# EAGLE design transponder-4.3 (EAGLE 9.6.1)
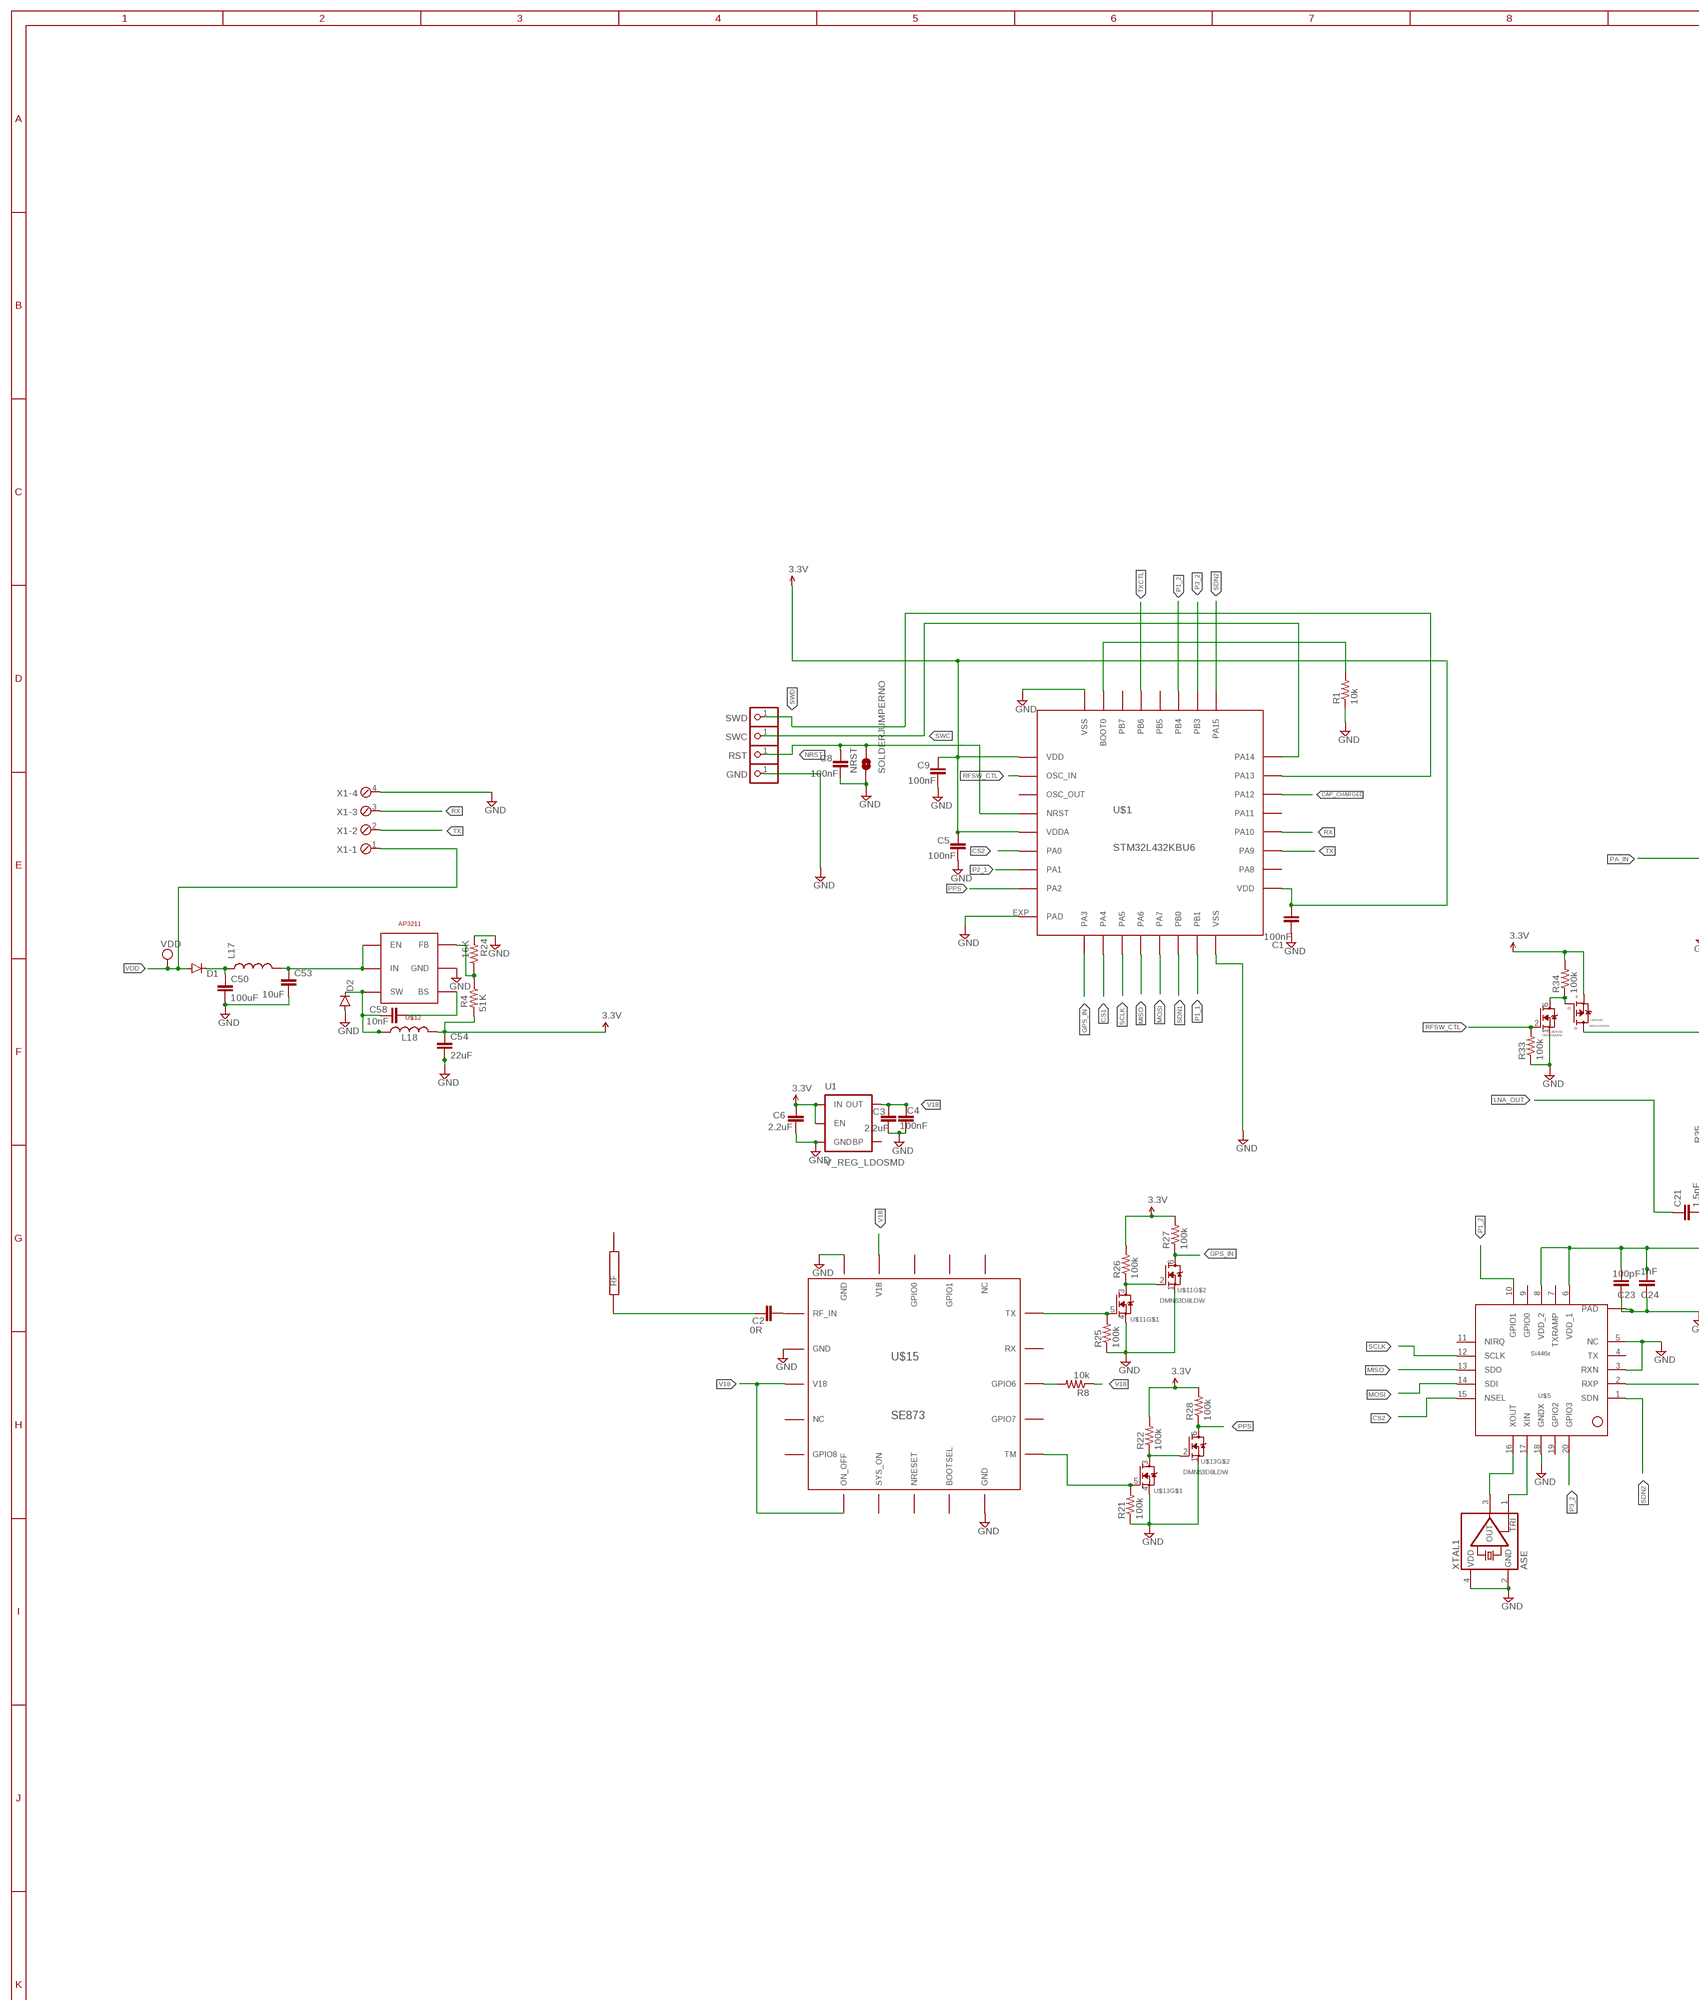
[diagram p0: schematic, sheet 1, part 1 of 3]
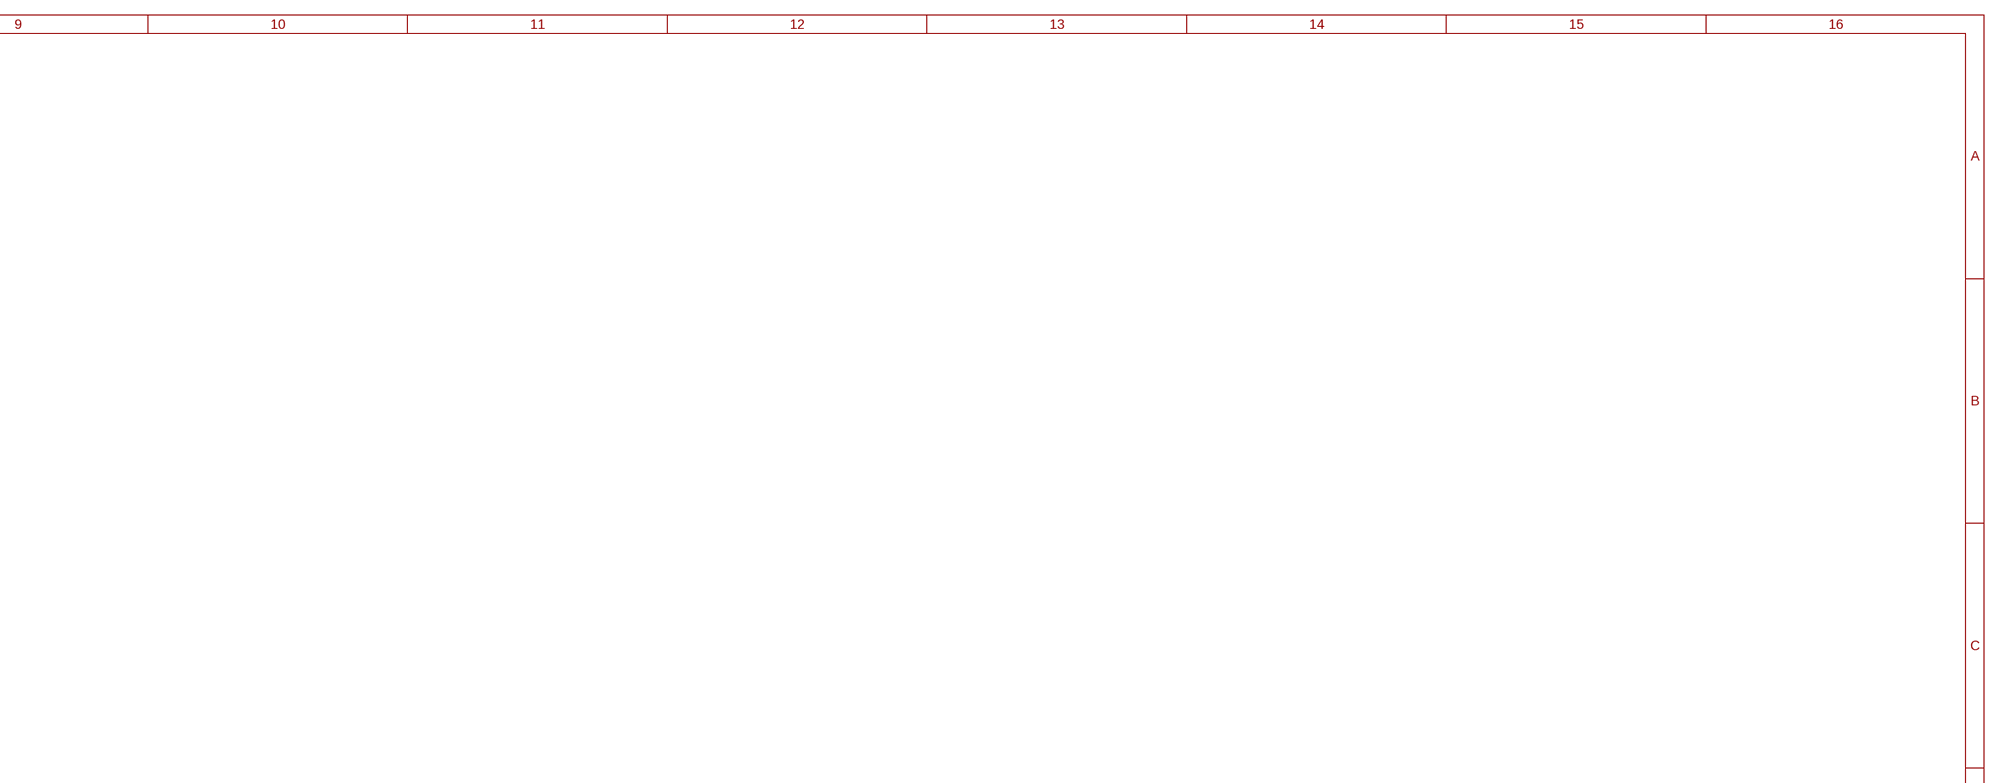
[diagram p1: schematic, sheet 1, part 2 of 3]
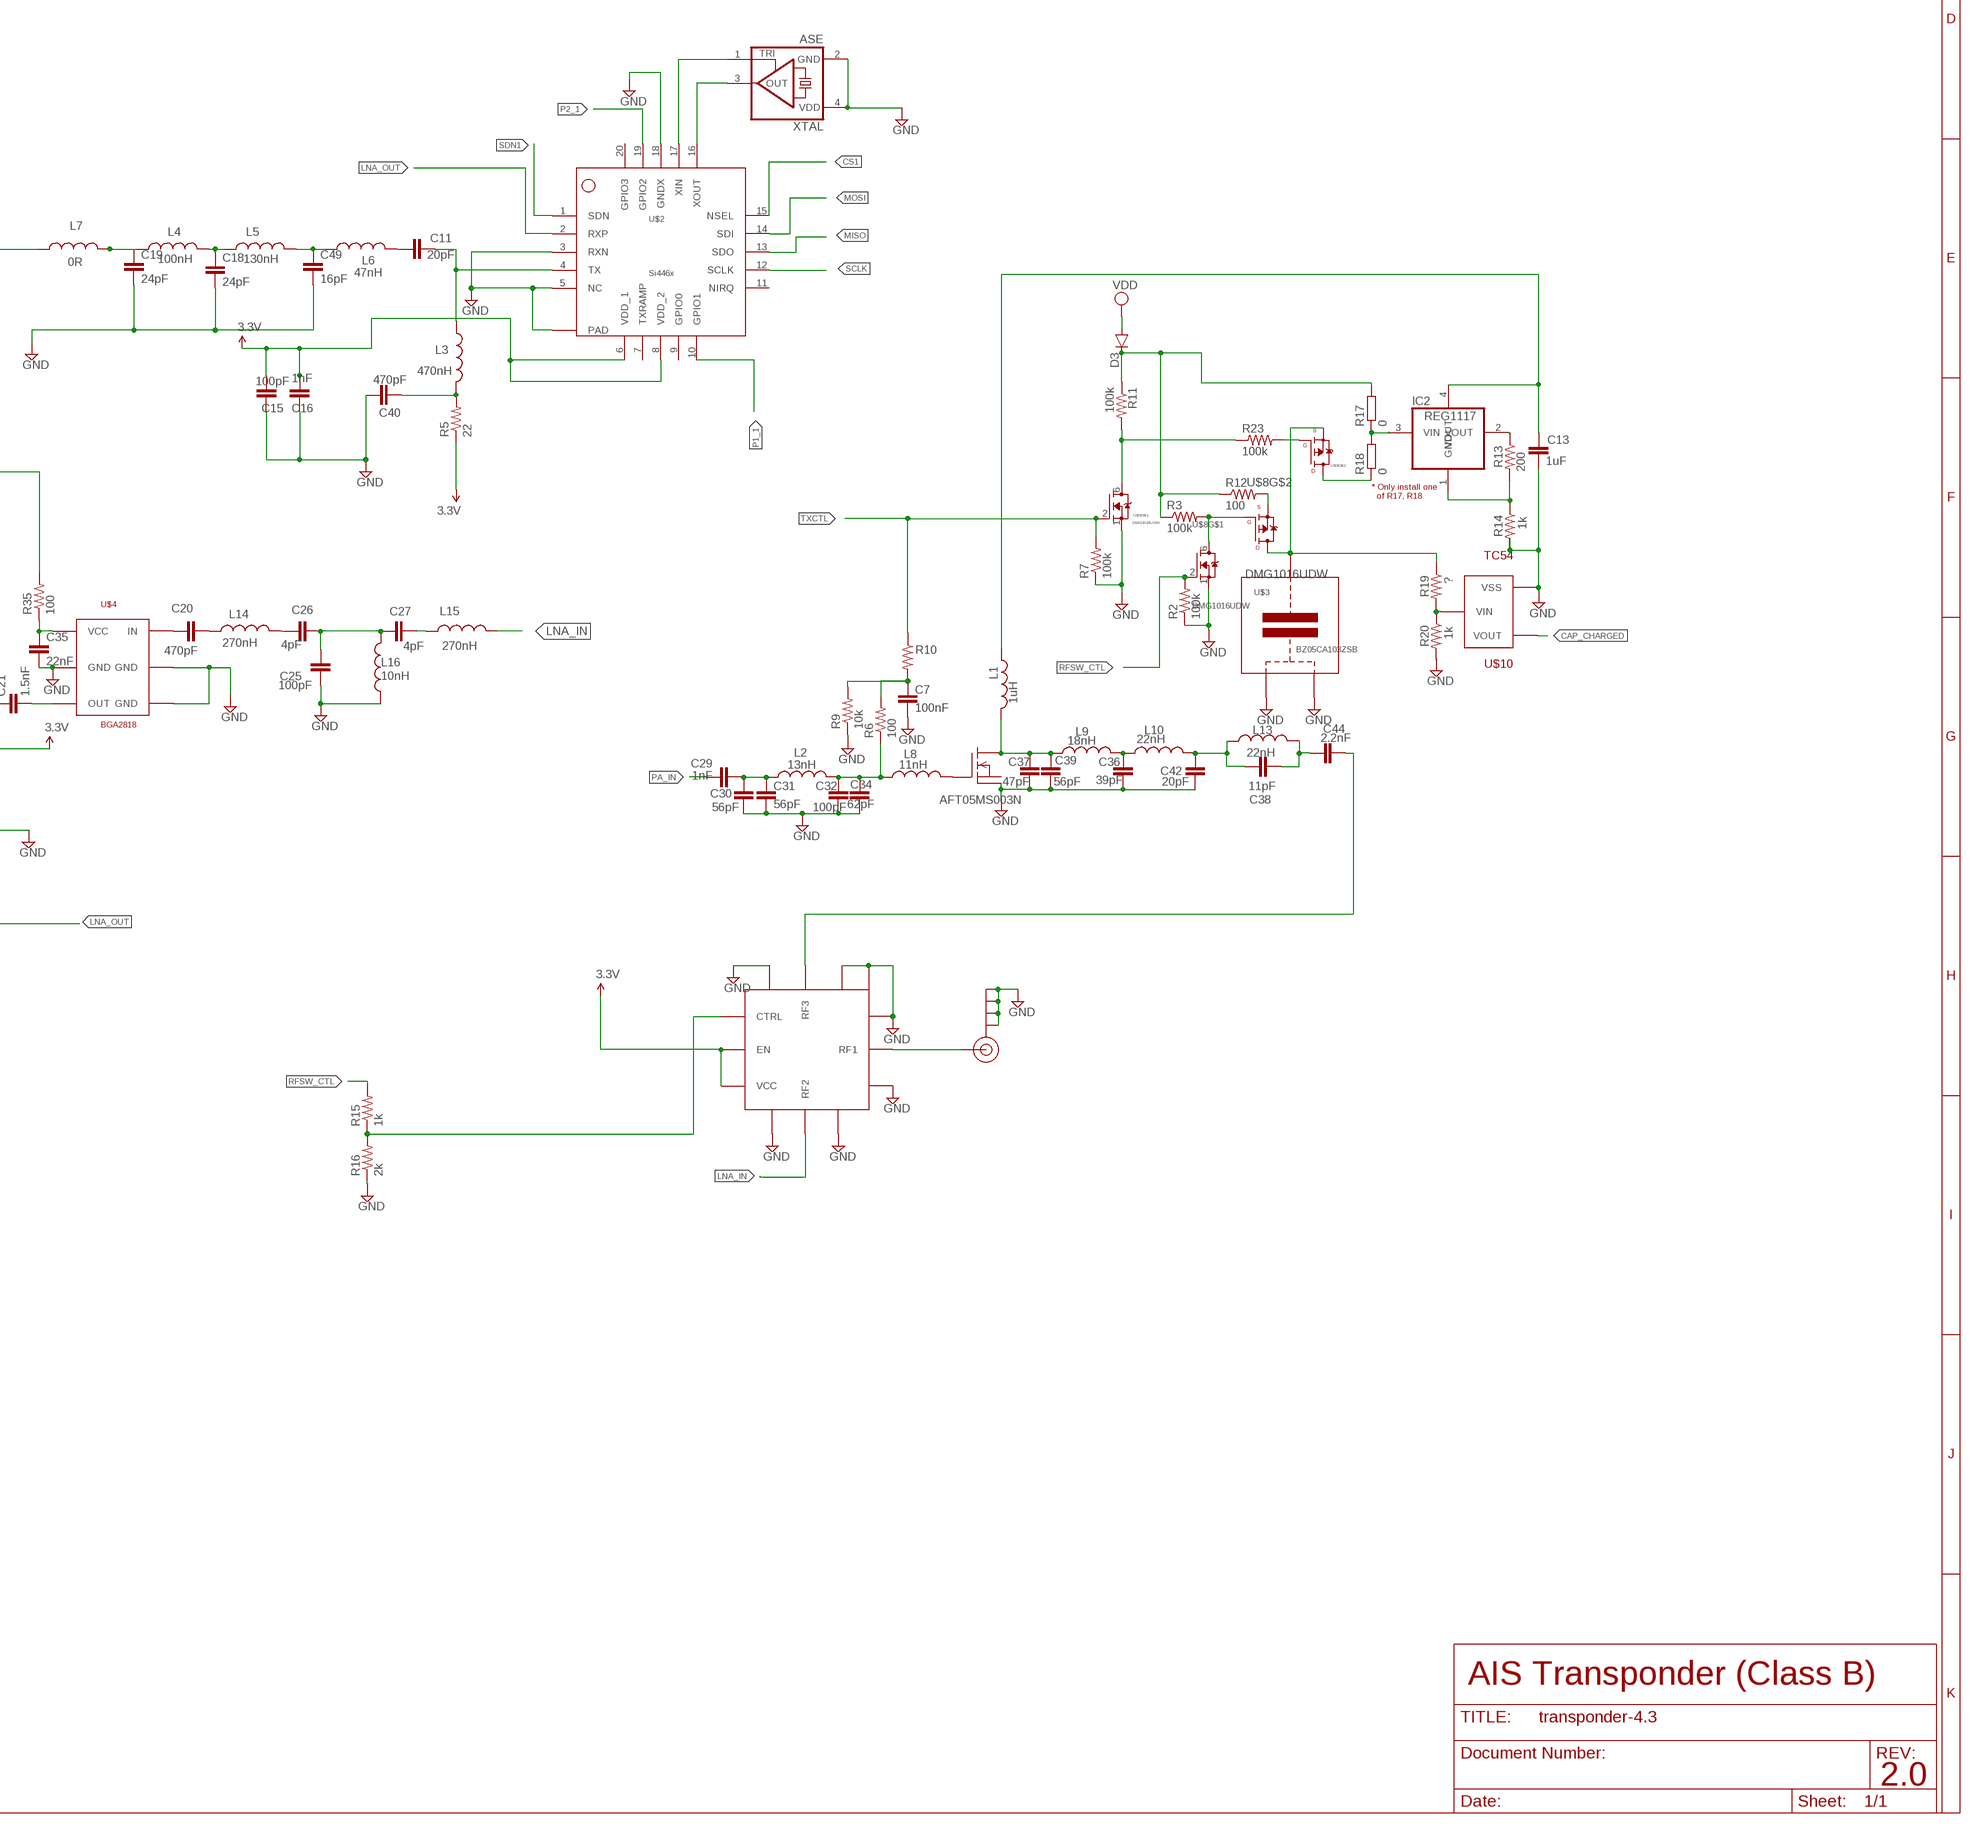
[diagram p2: schematic, sheet 1, part 3 of 3]

## Parts
C1  100nF  CAP0603-CAP  [0603-CAP]
C2  0R  CAP0603-CAP  [0603-CAP]
C3  2.2uF  CAP0603-CAP  [0603-CAP]
C4  100nF  CAP0603-CAP  [0603-CAP]
C5  100nF  CAP0603-CAP  [0603-CAP]
C6  2.2uF  CAP0603-CAP  [0603-CAP]
C7  100nF  CAP0603-CAP  [0603-CAP]
C8  100nF  CAP0603-CAP  [0603-CAP]
C9  100nF  CAP0603-CAP  [0603-CAP]
C11  20pF  CAP0603-CAP  [0603-CAP]
C13  1uF  CAP0603-CAP  [0603-CAP]
C15  100pF  CAP0603-CAP  [0603-CAP]
C16  1nF  CAP0603-CAP  [0603-CAP]
C18  24pF  CAP0603-CAP  [0603-CAP]
C19  24pF  CAP0603-CAP  [0603-CAP]
C20  470pF  CAP0603-CAP  [0603-CAP]
C21  1.5nF  CAP0603-CAP  [0603-CAP]
C23  100pF  CAP0603-CAP  [0603-CAP]
C24  1nF  CAP0603-CAP  [0603-CAP]
C25  100pF  CAP0603-CAP  [0603-CAP]
C26  4pF  CAP0603-CAP  [0603-CAP]
C27  4pF  CAP0603-CAP  [0603-CAP]
C29  1nF  CAP0603-CAP  [0603-CAP]
C30  56pF  CAP0603-CAP  [0603-CAP]
C31  56pF  CAP0603-CAP  [0603-CAP]
C32  100pF  CAP0603-CAP  [0603-CAP]
C34  62pF  CAP0603-CAP  [0603-CAP]
C35  22nF  CAP0603-CAP  [0603-CAP]
C36  39pF  CAP0805  [0805]
C37  47pF  CAP0805  [0805]
C38  11pF  CAP0805  [0805]
C39  56pF  CAP0805  [0805]
C40  470pF  CAP0603-CAP  [0603-CAP]
C42  20pF  CAP0805  [0805]
C44  2.2nF  CAP0805  [0805]
C49  16pF  CAP0603-CAP  [0603-CAP]
C50  100uF  CAP1210  [1210]
C53  10uF  CAP0805  [0805]
C54  22uF  CAP0805  [0805]
C58  10nF  CAP0603-CAP  [0603-CAP]
D1  DIODESOD123  [SOD-123]
D2  DIODESOD123  [SOD-123]
D3  DIODESOD123  [SOD-123]
GND  PINHD-1X1  [1X01]
IC2  REG1117  [SOT223]
J$1  SMA_EDGE  [SMA-EDGE]
L1  1uH  INDUCTOR0805  [0805]
L2  13nH  INDUCTOR0603  [0603]
L3  470nH  INDUCTOR0603  [0603]
L4  100nH  INDUCTOR0603  [0603]
L5  130nH  INDUCTOR0603  [0603]
L6  47nH  INDUCTOR0603  [0603]
L7  0R  INDUCTOR0603  [0603]
L8  11nH  INDUCTOR0603  [0603]
L9  18nH  INDUCTOR0805  [0805]
L10  22nH  INDUCTOR0805  [0805]
L13  22nH  INDUCTOR0805  [0805]
L14  270nH  INDUCTOR0603  [0603]
L15  270nH  INDUCTOR0603  [0603]
L16  10nH  INDUCTOR0603  [0603]
L17  INDUCTOR1007  [1007]
L18  INDUCTOR0805  [0805]
NRST  SOLDERJUMPERNO  [SJ_2S-NO]
R1  10k  RESISTOR0603-RES  [0603-RES]
R2  100k  RESISTOR0603-RES  [0603-RES]
R3  100k  RESISTOR0603-RES  [0603-RES]
R4  51K  RESISTOR0603-RES  [0603-RES]
R5  22  RESISTOR0603-RES  [0603-RES]
R6  100  RESISTOR0603-RES  [0603-RES]
R7  100k  RESISTOR0603-RES  [0603-RES]
R8  10k  RESISTOR0603-RES  [0603-RES]
R9  10k  RESISTOR0603-RES  [0603-RES]
R10  RESISTOR0603-RES  [0603-RES]
R11  100k  RESISTOR0603-RES  [0603-RES]
R12  100  RESISTOR0603-RES  [0603-RES]
R13  200  RESISTOR0603-RES  [0603-RES]
R14  1k  RESISTOR0603-RES  [0603-RES]
R15  1k  RESISTOR0603-RES  [0603-RES]
R16  2k  RESISTOR0603-RES  [0603-RES]
R17  0  R-EU_R0603  [R0603]
R18  0  R-EU_R0603  [R0603]
R19  ?  RESISTOR0603-RES  [0603-RES]
R20  1k  RESISTOR0603-RES  [0603-RES]
R21  100k  RESISTOR0603-RES  [0603-RES]
R22  100k  RESISTOR0603-RES  [0603-RES]
R23  100k  RESISTOR0603-RES  [0603-RES]
R24  16K  RESISTOR0603-RES  [0603-RES]
R25  100k  RESISTOR0603-RES  [0603-RES]
R26  100k  RESISTOR0603-RES  [0603-RES]
R27  100k  RESISTOR0603-RES  [0603-RES]
R28  100k  RESISTOR0603-RES  [0603-RES]
R33  100k  RESISTOR0603-RES  [0603-RES]
R34  100k  RESISTOR0603-RES  [0603-RES]
R35  100  RESISTOR0603-RES  [0603-RES]
RST  PINHD-1X1  [1X01]
SWC  PINHD-1X1  [1X01]
SWD  PINHD-1X1  [1X01]
U1  V_REG_LDOSMD  [SOT23-5]
U$1  STM32L432KBU6  STM32F051XXXX  [QFN32]
U$2  SI4463  [SI4463]
U$3  BZ05CA103ZSB  [BZ05]
U$4  BGA2818  BGA2869  [SOT363]
U$5  SI4463  [SI4463]
U$6  SKYWORKS-13330397LF  [QFN12]
U$7  AFT05MS003N  AFT0SMS003N  [SOT-89]
U$8  DMG1016UDW  [SOT363]
U$9  DMG1016UDW  [SOT363]
U$10  TC54  [SOT23]
U$11  DMN63D8LDW  [SOT363]
U$12  AP3211  [SOT23-6]
U$13  DMN63D8LDW  [SOT363]
U$14  1575AT43A0040E  [1575AT43A0040E]
U$15  SE873  [SE873]
U$19  DMG1016UDW  [SOT363]
X1  MPT4  [4POL254]
XTAL  ASE  [ASE]
XTAL1  ASE  [ASE]

## Nets
3.3V: C1.2 C5.2 C6.2 C9.2 C15.1 C16.1 C23.1 C24.1 C54.1 L18.2 R4.2 R5.1 R22.2 R26.2 R27.2 R28.2 R34.2 U1.1(IN) U1.3(EN) U$1.1(VDD) U$1.5(VDDA) U$1.17(VDD) U$2.6(VDD_1) U$2.8(VDD_2) U$5.6(VDD_1) U$5.8(VDD_2) U$6.P$8(EN) U$6.P$9(VCC) U$19.4(S)
CAP_CHARGED: U$1.22(PA12) U$10.1(VOUT)
CS1: U$1.10(PA4) U$2.15(NSEL)
CS2: U$1.6(PA0) U$5.15(NSEL)
GND: C1.1 C3.1 C4.1 C5.1 C6.1 C7.2 C8.1 C9.1 C13.2 C15.2 C16.2 C18.2 C19.2 C23.2 C24.2 C25.1 C30.2 C31.2 C32.2 C34.2 C35.2 C36.2 C37.2 C39.2 C40.2 C42.2 C49.2 C50.2 C53.2 C54.2 D2.A GND.1 J$1.GND@0(GND) J$1.GND@1(GND) J$1.GND@2(GND) J$1.GND@3(GND) L16.1 NRST.1 R1.1 R2.1 R7.1 R9.1 R14.2 R16.1 R20.2 R21.1 R24.2 R25.1 R33.1 U1.2(GND) U$1.16(VSS) U$1.32(VSS) U$1.EXP(PAD) U$2.3(RXN) U$2.5(NC) U$2.18(GNDX) U$2.EXP(PAD) U$3.P$1 U$3.P$2 U$4.2(GND) U$4.4(GND) U$4.5(GND) U$5.3(RXN) U$5.5(NC) U$5.18(GNDX) U$5.EXP(PAD) U$6.P$1(GND) U$6.P$3(GND) U$6.P$4(GND) U$6.P$6(GND) U$6.P$10(GND) U$6.P$12(GND) U$7.2@1(PAD) U$8.1(S) U$9.1(S) U$10.2(VSS) U$11.1(S) U$11.4(S) U$12.2(GND) U$13.1(S) U$13.4(S) U$15.P$2(GND) U$15.P$10(GND) U$15.P$20(GND) U$19.1(S) X1.4 XTAL1.2(GND) XTAL1.4(VDD) XTAL.2(GND) XTAL.4(VDD)
GNSS_RF: C2.2 U$14.P$1(RF)
GPS_IN: R27.1 U$1.9(PA3) U$11.6(D)
LNA_IN: L15.2 U$6.P$11(RF2)
LNA_OUT: C21.1 U$2.2(RXP) U$5.2(RXP)
LNAPWR: C35.1 R35.1 U$4.1(VCC)
LNAPWR1: R35.2 U$19.3(D)
MISO: U$1.12(PA6) U$2.13(SDO) U$5.13(SDO)
MOSI: U$1.13(PA7) U$2.14(SDI) U$5.14(SDI)
N$1: U$2.17(XIN) XTAL.1(TRI)
N$2: C19.1 L4.1 L7.2
N$3: C18.1 L4.2 L5.1
N$4: R1.2 U$1.31(BOOT0)
N$5: R19.1 U$3.P$3 U$8.3(D) U$9.4(S)
N$6: R21.2 U$13.5(G) U$15.P$11(TM)
N$7: R11.2 R23.1 U$9.6(D)
N$8: C11.1 L3.1 U$2.4(TX)
N$9: R22.1 U$13.2(G) U$13.3(D)
N$10: C20.1 U$4.6(IN)
N$11: C21.2 U$4.3(OUT)
N$12: R25.2 U$11.5(G) U$15.P$15(TX)
N$13: U$2.16(XOUT) XTAL.3(OUT)
N$14: R26.1 U$11.2(G) U$11.3(D)
N$15: C20.2 L14.1
N$18: R23.2 U$9.5(G)
N$19: C53.1 L17.2 U$12.4(EN) U$12.5(IN)
N$20: C49.1 L5.2 L6.1
N$22: R34.1 U$19.5(G) U$19.6(D)
N$23: C37.1 C39.1 L1.2 L9.1 U$7.3(D)
N$25: L8.2 U$7.1(G)
N$26: C32.1 C34.1 L2.2 L8.1 R6.1
N$27: C29.2 C30.1 C31.1 L2.1
N$28: C36.1 L9.2 L10.1
N$29: C38.1 C42.1 L10.2 L13.1
N$30: R8.2 U$15.P$13(GPIO6)
N$31: IC2.3(VIN) R17.1 R18.2
N$32: IC2.2(VOUT) R13.1
N$33: C2.1 U$15.P$1(RF_IN)
N$34: C25.2 C26.1 C27.2 L16.2
N$35: C27.1 L15.1
N$36: C26.2 L14.2
N$37: R18.1 U$9.3(D)
N$38: U$5.17(XIN) XTAL1.1(TRI)
N$39: U$5.16(XOUT) XTAL1.3(OUT)
N$40: R3.2 U$8.5(G) U$8.6(D)
N$41: R12.2 U$8.4(S)
N$42: R19.2 R20.1 U$10.3(VIN)
N$43: C38.2 C44.1 L13.2
N$45: J$1.SIG(SIGNAL) U$6.P$2(RF1)
N$46: C50.1 D1.C L17.1
N$47: IC2.1(GND) R13.2 R14.1
N$48: D3.C R3.1 R11.1 R12.1 R17.2
N$50: C11.2 L6.2
N$51: C40.1 L3.2 R5.2
N$56: C58.2 U$12.1(BS)
N$58: C58.1 D2.C L18.1 U$12.6(SW)
N$61: R4.1 R24.1 U$12.3(FB)
N$89: C7.1 R6.2 R9.2 R10.2
NRST: C8.2 NRST.2 RST.1 U$1.4(NRST)
P1_1: U$1.15(PB1) U$2.10(GPIO1)
P1_2: U$1.27(PB4) U$5.10(GPIO1)
P2_1: U$1.7(PA1) U$2.19(GPIO2)
P3_2: U$1.26(PB3) U$5.20(GPIO3)
PA_IN: C29.1 L7.1
PA_OUT: C44.2 U$6.P$5(RF3)
PA_PWR: C13.1 IC2.4(VOUT) L1.1
PPS: R28.1 U$1.8(PA2) U$13.6(D)
RFSW_CTL: R2.2 R15.2 R33.2 U$1.2(OSC_IN) U$8.2(G) U$19.2(G)
RFSWCTL: R15.1 R16.2 U$6.P$7(CTRL)
RX: U$1.20(PA10) X1.3
SCLK: U$1.11(PA5) U$2.12(SCLK) U$5.12(SCLK)
SDN1: U$1.14(PB0) U$2.1(SDN)
SDN2: U$1.25(PA15) U$5.1(SDN)
SWC: SWC.1 U$1.24(PA14)
SWD: SWD.1 U$1.23(PA13)
TX: U$1.19(PA9) X1.2
TXCTL: R7.2 R10.1 U$1.29(PB6) U$9.2(G)
V18: C3.2 C4.2 R8.1 U1.5(OUT) U$15.P$3(V18) U$15.P$6(ON_OFF) U$15.P$19(V18)
VDD: D1.A D3.A X1.1
Unconnected: U1.4(BP) U$1.3(OSC_OUT) U$1.18(PA8) U$1.21(PA11) U$1.28(PB5) U$1.30(PB7) U$2.7(TXRAMP) U$2.9(GPIO0) U$2.11(NIRQ) U$2.20(GPIO3) U$5.4(TX) U$5.7(TXRAMP) U$5.9(GPIO0) U$5.11(NIRQ) U$5.19(GPIO2) U$6.P$13(GND) U$7.2(S) U$14.P$2(PAD) U$15.P$4(NC) U$15.P$5(GPIO8) U$15.P$7(SYS_ON) U$15.P$8(NRESET) U$15.P$9(BOOTSEL) U$15.P$12(GPIO7) U$15.P$14(RX) U$15.P$16(NC) U$15.P$17(GPIO1) U$15.P$18(GPIO0)

## Notes on the sheet
- * Only install one
    of R17, R18
- AIS Transponder (Class B)
- 2.0

## Library data of the parts
C1-C9 C11 C13 C15 C16 C18 C19 C23-C27 C29-C32 C34-C40 C42 C44 C49 C53 C54 C58 = SparkFun-Capacitors:CAP: Capacitor Standard 0603 ceramic capacitor, and 0.1" leaded capacitor.
C20 C21 C50 = SparkFun-Passives:CAP: Capacitor Standard 0603 ceramic capacitor, and 0.1" leaded capacitor.
D1-D3 = SparkFun-DiscreteSemi:DIODE: Diode These are standard reverse protection diodes and small signal diodes. SMA package can handle up to about 1A. SOD-323 can handle about 200mA. What the SOD-323 package when ordering, there are some mfgs out there that are 5-pin packages.
GND RST SWC SWD = adafruit:PINHD-1X1: Pin header 1x1 for 0.1" spacing With round pins
IC2 = burr-brown:REG1117: 800mA and 1A Low Dropout (LDO) Positive Regulator 1.8V, 2.5V, 2.85V, 3.3V, 5V, and Adj
J$1 = SparkFun-Connectors:SMA_EDGE: SMA Antenna Connector End launch SMA connector. The paste layer has been removed so that the connector can be hand soldered onto the board after reflow.
L1-L10 L13-L18 = SparkFun-Passives:INDUCTOR: Inductors Basic Inductor/Choke - 0603 and 1206. Footprints are not proven and vary greatly between part numbers. INDUCTOR POWER 3.3UH 4.0A SMD 0.197" L x 0.197" W x 0.177" H (5.00mm x 5.00mm x 4.50mm)
NRST = SparkFun-Retired:SOLDERJUMPER: Solder Jumper Standard SMD solder jumper. Used to automate production. Two varients : Normally Open and Normally Closed are the same, but have different paste layers. NC will have a large amount of paste and should jumper during reflow.
R1-R16 R19-R28 R33-R35 = SparkFun-Passives:RESISTOR: Resistor Basic schematic elements and footprints for 0603, 1206, and PTH resistors.
R17 R18 = rcl:R-EU_: RESISTOR, European symbol
U1 = SparkFun-PowerIC:V_REG_LDO: Voltage Regulator LDO Standard 150mA LDO voltage regulator in SOT-23 layout. Micrel part MIC5205. BP (by-pass) pin is used to lower output noise with 470pF cap.
U$1 = stm32:STM32F051XXXX
U$2 U$5 = EZRadioPRO:SI4463
U$3 = avx-supercaps:BZ05CA103ZSB: AVX BestCap Supercapacitor
U$4 = nxp:BGA2869
U$6 = skyworks:SKYWORKS-13330397LF: SP2T RF Switch
U$7 = nxp:AFT0SMS003N
U$8 U$9 U$19 = diodesinc:DMG1016UDW: N/P Channel MOSFET pair
U$10 = microchip-misc:TC54
U$11 U$13 = diodesinc:DMN63D8LDW: Dual N-Channel MOSFET
U$12 = diodesinc:AP3211
U$14 = johanson-technology:1575AT43A0040E: SMD Ceramic GNSS Antenna
U$15 = telit:SE873: Telit SE873 GNSS Receiver
X1 = con-phoenix-254:MPT4: PHOENIX CONNECTOR; OC_FARNELL: unknown; OC_NEWARK: unknown
XTAL XTAL1 = crystal:ASE: 3.3Vdc CMOS SMD CRYSTAL CLOCK OSCILLATOR SOurce: www.abracon.com; OC_FARNELL: unknown; OC_NEWARK: unknown

## Board
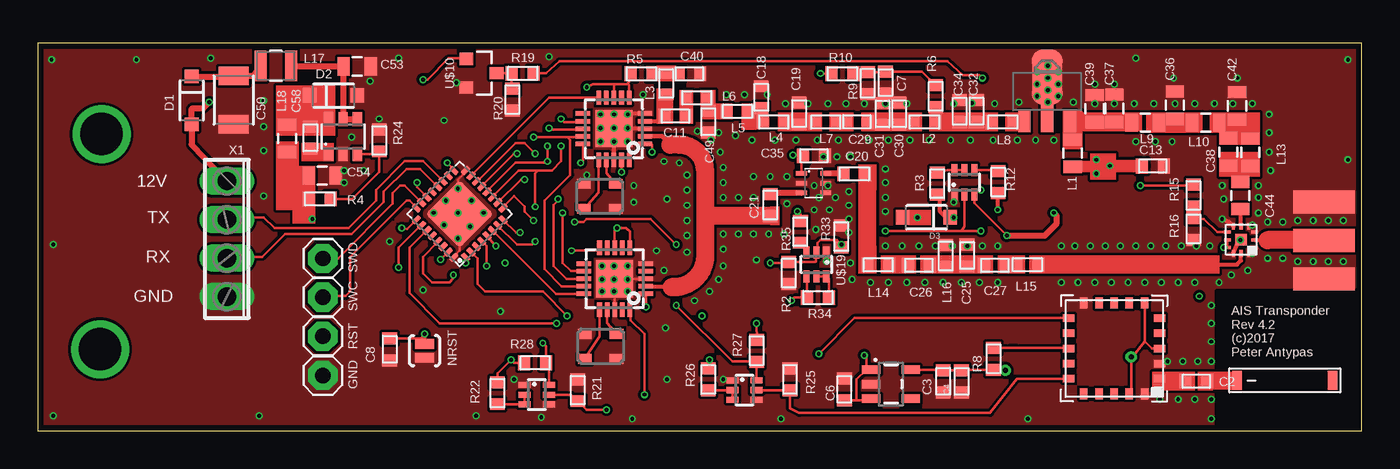
[diagram p3: board, top side]
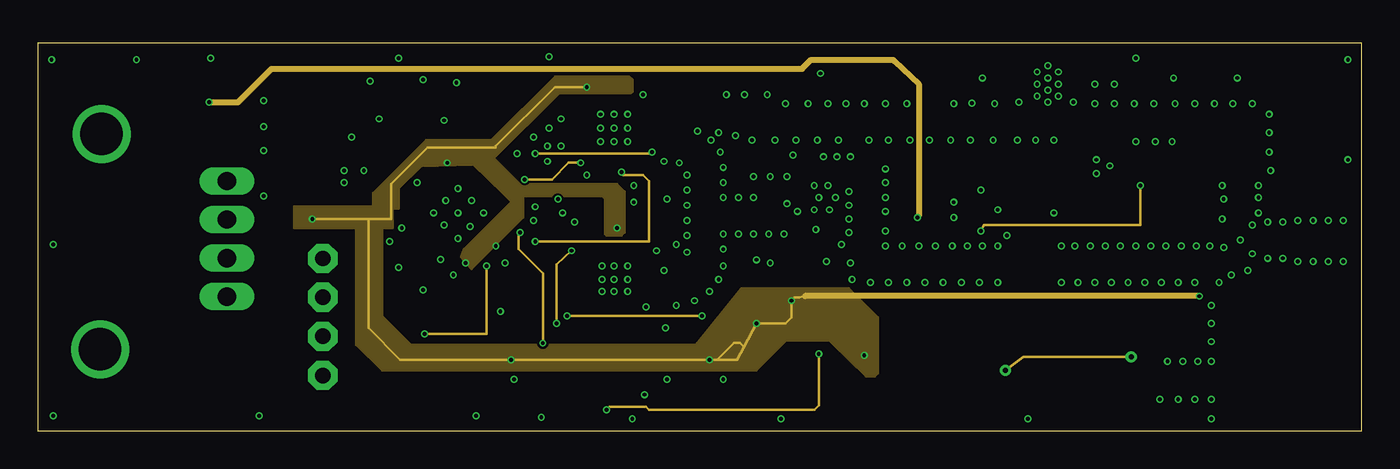
[diagram p4: board, inner layer Layer2]
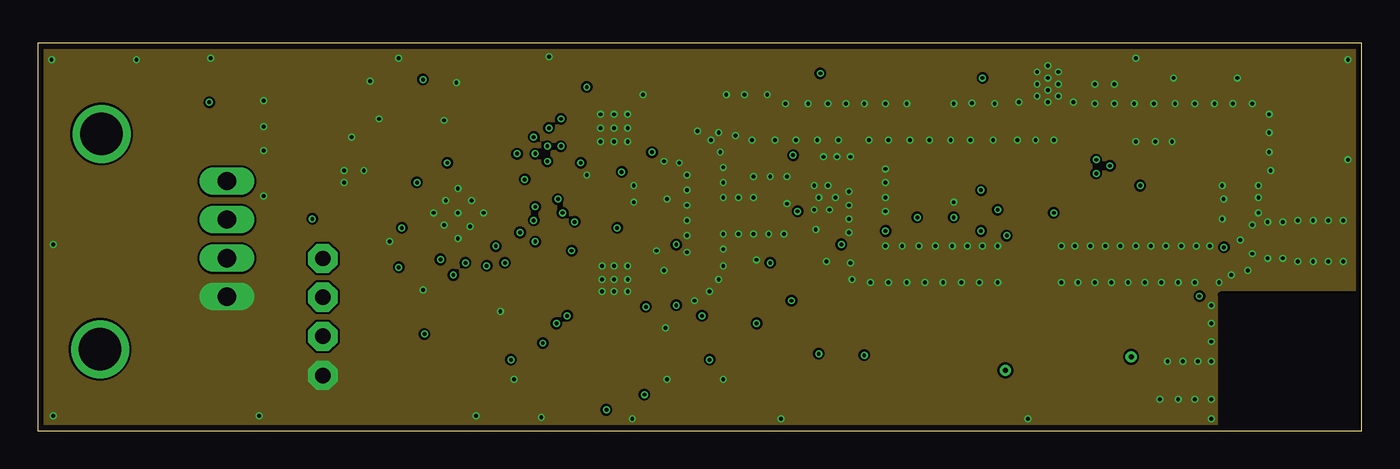
[diagram p5: board, inner layer Layer3]
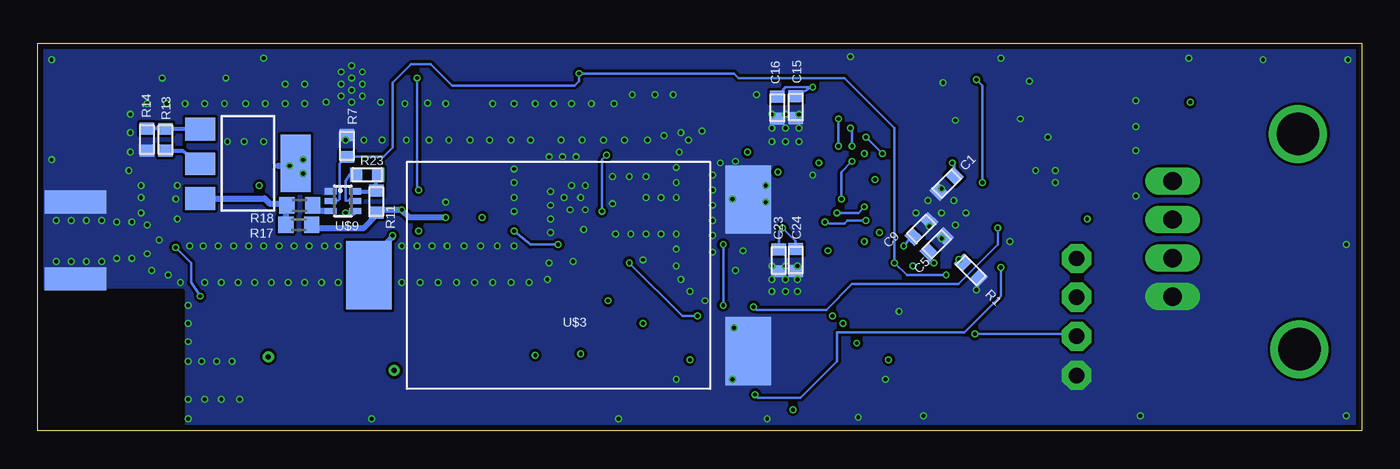
[diagram p6: board, bottom side, seen from below]

Size 87.3 x 25.6 mm. Coordinates in mm from the lower left corner, seen from the top.
Outline: 0,0 87.3,0 87.3,25.6 0,25.6 0,0
Copper layers (1*2+15*16): Top 0.035mm / dielectric 0.17mm / Layer2 0.018mm / dielectric 1.2mm / Layer3 0.018mm / dielectric 0.17mm / Bottom 0.035mm
Design rules "default *": minimum track width 5mil, minimum drill 10mil, track to track 6mil, track to pad 6mil, pad to pad 6mil, via to via 6mil, smd to smd 0mil, copper to edge 15mil, drill to drill 6mil, minimum pad ring 4mil, minimum via ring 4mil, stop-mask expansion 4mil, vias tented up to drill 10mm, thermal gap 10mil
tRestrict: area 77.8,0 to 87.3,9.2
bRestrict: area 77.8,0 to 87.3,9.2

### Footprints (pad centres in the part's own frame; a part is rotated, then mirrored left to right if it is on the bottom)
0603-CAP = smd 0.787 x 0.965: 1 -0.723,0; 2 0.723,0
0805 = smd 0.8 x 1.2: 1 -0.9,0; 2 0.9,0
1210 = smd 1.2 x 2: 1 -1.6,0; 2 1.6,0
SOD-123 = smd 0.9 x 0.95: A 1.575,0; C -1.575,0
1X01 = drill 1.016 pad 1.93 octagon: 1 0,0
SOT223 = smd 1.499 x 2.007: 1 -2.261,-3.15; 2 0.025,-3.15; 3 2.311,-3.15 | smd 3.81 x 2.007: 4 0,3.15
SMA-EDGE = smd 1.524 x 4.064: GND@0 0,0; GND@1 5.08,0; SIG 2.54,0 | smd 1.524 x 4.064 bottom: GND@2 0,0; GND@3 5.08,0
0603 = smd 0.787 x 0.965: 1 -0.723,0; 2 0.723,0
1007 = smd 2 x 0.8: 1 0,1; 2 0,-1
SJ_2S-NO = smd 0.635 x 1.27: 1 -0.45,0; 2 0.45,0
0603-RES = smd 0.787 x 0.965: 1 -0.723,0; 2 0.723,0
R0603 = smd 1 x 1.1: 1 -0.85,0; 2 0.85,0
SOT23-5 = smd 0.55 x 1.2: 1 -0.95,-1.3; 2 0,-1.3; 3 0.95,-1.3; 4 0.95,1.3; 5 -0.95,1.3
QFN32 = smd 0.6 x 0.3: 1 -2.3,1.75; 2 -2.3,1.25; 3 -2.3,0.75; 4 -2.3,0.25; 5 -2.3,-0.25; 6 -2.3,-0.75; 7 -2.3,-1.25; 8 -2.3,-1.75; 17 2.3,-1.75; 18 2.3,-1.25; 19 2.3,-0.75; 20 2.3,-0.25; 21 2.3,0.25; 22 2.3,0.75; 23 2.3,1.25; 24 2.3,1.75 | smd 0.3 x 0.6: 9 -1.75,-2.3; 10 -1.25,-2.3; 11 -0.75,-2.3; 12 -0.25,-2.3; 13 0.25,-2.3; 14 0.75,-2.3; 15 1.25,-2.3; 16 1.75,-2.3; 25 1.75,2.3; 26 1.25,2.3; 27 0.75,2.3; 28 0.25,2.3; 29 -0.25,2.3; 30 -0.75,2.3; 31 -1.25,2.3; 32 -1.75,2.3 | smd 3.2 x 3.2: EXP 0,0
SI4463 = smd 0.95 x 0.3: 1 -2.05,1; 2 -2.05,0.5; 3 -2.05,0; 4 -2.05,-0.5; 5 -2.05,-1; 11 2.05,-1; 12 2.05,-0.5; 13 2.05,0; 14 2.05,0.5; 15 2.05,1 | smd 0.3 x 0.95: 6 -1,-2.05; 7 -0.5,-2.05; 8 0,-2.05; 9 0.5,-2.05; 10 1,-2.05; 16 1,2.05; 17 0.5,2.05; 18 0,2.05; 19 -0.5,2.05; 20 -1,2.05 | smd 2.45 x 2.45: EXP 0,0
BZ05 = smd 3 x 4.5: P$1 -12.5,5; P$2 -12.5,-5; P$3 12.5,0
SOT363 = smd 0.3 x 0.7: 1 -0.65,-0.8; 2 0,-0.8; 3 0.65,-0.8; 4 0.65,0.8; 5 0,0.8; 6 -0.65,0.8
QFN12 = smd 0.44 x 0.2: P$1 -0.9,0.5; P$2 -0.9,0; P$3 -0.9,-0.5; P$7 0.9,-0.5; P$8 0.9,0; P$9 0.9,0.5 | smd 0.2 x 0.44: P$4 -0.5,-0.9; P$5 0,-0.9; P$6 0.5,-0.9; P$10 0.5,0.9; P$11 0,0.9; P$12 -0.5,0.9 | smd 0.76 x 0.76: P$13 0,0
SOT-89 = smd 0.8 x 1.4: 1 -1.499,-1.981; 3 1.499,-1.981 | smd 0.8 x 1.9: 2 0,-1.727 | smd 2.032 x 3.65: 2@1 0,0.94
SOT363' = smd 0.4 x 0.8: 1 -0.65,-0.8; 2 0,-0.8; 3 0.65,-0.8; 4 0.65,0.8; 5 0,0.8; 6 -0.65,0.8
SOT23 = smd 0.8 x 0.9: 1 -0.95,-1; 2 0.95,-1; 3 0,1
SOT23-6 = smd 0.6 x 0.9: 1 -0.95,-1.15; 2 0,-1.15; 3 0.95,-1.15; 4 0.95,1.15; 5 0,1.15; 6 -0.95,1.15
1575AT43A0040E = smd 0.635 x 1.27: P$1 -3.2,0; P$2 3.1,0
SE873 = smd 0.75 x 0.5: P$1 -3,2; P$2 -3,1; P$3 -3,0; P$4 -3,-1; P$5 -3,-2; P$11 3,-2; P$12 3,-1; P$13 3,0; P$14 3,1; P$15 3,2 | smd 0.5 x 0.75: P$6 -2,-3; P$7 -1,-3; P$8 0,-3; P$9 1,-3; P$10 2,-3; P$16 2,3; P$17 1,3; P$18 0,3; P$19 -1,3; P$20 -2,3
4POL254 = drill 1.2 long: 1 -3.81,0; 2 -1.27,0; 3 1.27,0; 4 3.81,0
ASE = smd 0.9 x 0.65: 1 -1.05,-0.825; 2 1.05,-0.825; 3 1.05,0.825; 4 -1.05,0.825

### Placement (x,y rotation side)
C1  27.36,16.32 45 bottom
C2  76.39,3.29 0 top
C3  59.71,3.28 90 top
C4  60.91,3.27 90 top
C5  28.02,12.34 225 bottom
C6  53.19,2.75 270 top
C7  55.9,23 270 top
C8  23.2,5.4 90 top
C9  29.04,13.34 225 bottom
C11  42.04,20.79 0 top
C13  73.53,17.49 0 top
C15  37.31,21.38 270 bottom
C16  38.53,21.34 270 bottom
C18  47.71,22.02 90 top
C19  50.2,20.96 90 top
C20  53.84,16.97 0 top
C21  48.3,14.92 90 top
C23  38.43,11.27 270 bottom
C24  37.33,11.28 270 bottom
C25  61.27,11.59 270 top
C26  58.1,10.93 180 top
C27  63.11,10.93 180 top
C29  54.01,20.41 0 top
C30  56.8,20.94 90 top
C31  55.7,20.93 90 top
C32  61.9,21.12 90 top
C34  60.8,21.1 90 top
C35  51.17,18.17 0 top
C36  74.99,21.5 90 top
C37  70.99,21.29 90 top
C38  78.51,18.42 270 top
C39  69.69,21.27 90 top
C40  42.96,23.57 0 top
C42  79.09,21.46 90 top
C44  79.31,15.55 270 top
C49  44.2,20.41 270 top
C50  12.91,21.84 270 top
C53  21.06,24.06 0 top
C54  18.75,16.86 0 top
C58  17.97,19.35 270 top
D1  10.14,21.82 270 top
D2  19.5,22.14 0 top
D3  58.6,14.1 180 top
GND  18.79,3.67 270 top
IC2  73.45,17.66 270 bottom
J$1  84.82,10.03 90 top
L1  68.24,18.34 90 top
L2  58.48,20.4 0 top
L3  41.43,22.94 90 top
L4  48.53,20.4 180 top
L5  46.14,21.1 180 top
L6  43.45,22 180 top
L7  51.96,20.4 180 top
L8  63.63,20.4 0 top
L9  73.03,20.36 0 top
L10  77.02,20.36 0 top
L13  79.96,18.39 270 top
L14  55.42,10.97 0 top
L15  65.26,10.98 0 top
L16  59.88,11.55 270 top
L17  15.69,24.09 90 top
L18  16.44,19.31 270 top
NRST  25.5,5.3 90 top
R1  25.77,10.6 135 bottom
R2  49.52,10.43 90 top
R3  59.32,16.32 90 top
R4  18.59,15.32 180 top
R5  39.8,23.58 0 top
R6  59.22,22.09 90 top
R7  66.92,18.82 270 bottom
R8  63.02,4.77 90 top
R9  54.72,22.96 90 top
R10  53.05,23.58 0 top
R11  64.98,15.14 90 bottom
R12  63.32,16.43 90 top
R13  78.88,19.22 90 bottom
R14  80.11,19.24 270 bottom
R15  76.21,15.55 90 top
R16  76.21,13.34 90 top
R17  70.09,13.61 0 bottom
R18  70.03,14.89 180 bottom
R19  31.97,23.61 180 top
R20  31.29,21.88 270 top
R21  35.6,2.7 270 top
R22  30.3,2.5 90 top
R23  65.59,16.91 180 bottom
R24  22.51,19.18 90 top
R25  49.6,3.4 270 top
R26  44.2,3.4 90 top
R27  47.4,5.3 90 top
R28  32.8,4.5 180 top
R33  52.99,12.83 270 top
R34  51.44,8.81 180 top
R35  50.29,13.15 270 top
RST  18.79,6.25 270 top
SWC  18.79,8.84 270 top
SWD  18.79,11.39 270 top
U1  56.26,3.1 270 top
U$1  27.82,14.33 135 top
U$2  37.99,19.95 180 top
U$3  52.96,10.28 180 bottom
U$4  51.16,16.36 270 top
U$5  38.04,10.05 180 top
U$6  79.35,12.62 180 top
U$7  66.56,22.42 0 top
U$8  DMG1016UDW  [SOT363']  61.1,16.41 0 top
U$9  DMG1016UDW  [SOT363']  67.19,15.17 270 bottom
U$10  29.25,23.61 270 top
U$11  DMN63D8LDW  [SOT363']  46.6,2.7 270 top
U$12  20.12,19.43 0 top
U$13  DMN63D8LDW  [SOT363']  32.9,2.4 270 top
U$14  82.29,3.34 0 top
U$15  70.98,5.45 180 top
U$19  DMG1016UDW  [SOT363']  51.34,10.99 180 top
X1  12.46,12.68 270 top
XTAL  37.06,15.49 180 top
XTAL1  37.11,5.59 180 top

### Tracks (layer width: path | path; a pad name or v marks a point on that pad's centre or on a via)
3.3V  (via drill 0.25 pad 0.31)
  Top 0.152: L18.2 16.44,17.36 16.8,17 17.71,17 C54.1 17.85,15.14 R4.2 17.87,14.23 v18.1,14 | C6.2 54,2.03 | 54,2.03 54.84,2.03 U1.3 | U1.1 54.65,4.05 | 54.65,4.05 54,3.4 54,2.03 | U$2.8 37.99,22.81 37.9,22.9 | 37.9,22.9 36.6,22.9 v36.2,22.7 | U$2.6 38.99,22.81 38.9,22.9 | 38.9,22.9 37.9,22.9 | R5.1 39.28,23.58 38.9,22.9 | U$19.4 50.72,10.16 R34.2 49.91,8.81 v49.7,8.6 | R27.2 47.42,6.02 v47.4,7.1 | R26.2 44.2,4.6 v44.3,4.7 | U$5.8 38.04,13.24 v38.2,13.4 38.8,13.4 39.04,13.16 U$5.6 | U$6.P$8 U$6.P$9 v78.22,12.12 | 54.65,4.05 54.65,4.85 v54.5,5 | R28.2 31.4,4.5 v31.2,4.7 30.3,3.8 R22.2
  Top 0.154: U$1.5 v30.2,12.2 | U$1.1 28.21,11.39 v28.2,11.1 | U$1.17 27.43,17.27 v27,17.7
  Layer2 0.152: v18.1,14 21.8,14 | 21.8,14 23.3,14 23.3,16.3 25.7,18.7 30.2,18.7 30.2,18.8 34.1,22.7 v36.2,22.7 | 21.8,14 21.8,6.8 23.9,4.7 v31.2,4.7 v44.3,4.7 | v44.3,4.7 46.1,4.7 46.56,5.55 | 46.56,5.55 v47.4,7.1 49.3,7.1 49.7,7.5 v49.7,8.6 49.91,8.81 50.2,8.81 50.59,8.9 | v44.3,4.7 44.8,4.7 45.9,5.8 46.31,5.8 46.56,5.55
  Layer2 0.406: v76.6,8.9 50.59,8.9
  Bottom 0.152: 36.29,22.7 C15.1 | C16.1 38.05,22.64 37.99,22.7 36.29,22.7 | 36.29,22.7 v36.2,22.7 | v78.22,12.12 77.2,11.1 77.2,9.8 v76.6,8.9 | C23.1 38.43,13.17 v38.2,13.4 37.33,12.53 C24.1
  Bottom 0.154: C9.2 29.67,12.83 v30.2,12.2 | C5.2 28.53,11.07 v28.2,11.1 | C1.2 26.85,17.55 v27,17.7
  pour Layer2: 16.9,14.8 23.2,14.8 23.4,14.7 23.4,13.4 16.9,13.4
  pour Layer2: 22.1,14.8 22.1,15.7 25.6,19.2 28.9,19.2 32,16.1 32,15 31.7,14.7 28.7,17.6 25.3,17.5 23.8,16 23.8,14.7 22.2,14.7
  pour Layer2: 28.8,19.2 29.9,19.2 34.1,23.4 39,23.4 39.2,23.2 39.2,22.4 39.1,22.3 34.4,22.3 30,17.9 30,18
  pour Layer2: 21,13.6 21,5.7 22.7,4 47.4,4 50.2,6.8 50.2,9.4 46.4,9.4 43.4,5.7 24.6,5.7 22.7,7.6 22.7,13.6 22.5,13.8 21.2,13.8
  pour Layer2: 31.9,16.3 38.2,16.3 38.7,15.8 38.7,13.1 38.5,12.9 37.5,12.9 37.4,13 37.4,15.3 37.2,15.5 32,15.5 31.9,15.6
  pour Layer2: 50.1,9.4 53.5,9.4 55.4,7.5 55.4,3.8 55.2,3.6 54.6,3.6 50.1,8
  pour Layer2: 49.2,8.1 53.1,8.1 53.7,7.5 53.7,6.8 52.9,6 49.3,6 48.7,6.6 48.7,7.6
  pour Layer2: 31.9,15.8 32,15.8 32,14.1 28.6,10.7 27.9,11.5 28.1,12
CAP_CHARGED  (via drill 0.25 pad 0.31)
  Top 0.152: v25.4,23.2 25.7,23.2 27.1,24.6 28.21,24.6 U$10.1 | v25,16.4 25,16.09 U$1.22
  Bottom 0.152: v25,16.4 25,22.8 v25.4,23.2
CS1  (via drill 0.25 pad 0.31)
  Top 0.154: U$2.15 35.94,17.84 v35.8,17.7 | v32.1,16.6 31.86,16.6 U$1.10
  Layer2 0.154: v35.8,17.7 35,17.7 33.9,16.6 v32.1,16.6
CS2
  Top 0.154: U$5.15 34.16,9.05 U$1.6
GND  (via drill 0.25 pad 0.31)
  Top 0.152: v60.4,15.1 60.4,15.56 U$8.1
  Top 0.154: U$1.16 28.21,17.11 27.7,16.6 v27.7,16 | U$1.32 27.43,11.53 27.8,11.9 27.8,12.6 v27.7,12.7 | U$5.18 38.04,9.16 v38,9.2 | U$5.3 39.15,10.05 v38.9,10
  Top 0.254: U$2.18 v37.99,19.09 v38,19.1 | U$2.5 38.95,20.95 v38.9,20.9 v38.9,20 38.95,19.95 U$2.3 | U$6.P$10 79.15,12.45 v79.3,12.6 | v78.1,14 78.57,13.8 U$6.P$6
  other vias: 27.7,14.4 28.5,13.5 29.4,14.4 28.6,15.2 26.9,15.2 26.1,14.4 26.8,13.6 39.3,16.2 39.3,15.1 36.2,16.9 38,20 38,20.9 37.1,20 37.1,20.9 38.9,19.1 37.1,19.1 20.2,17.2 21.5,17.2 20.2,16.4 23.2,12.5 14.9,21.8 14.9,20.1 14.9,18.5 14.9,15.5 21.9,23.1 22.5,20.6 20.7,19.4 27.6,23 26.8,20.5 38,10 38,10.9 37.2,10 37.2,10.9 38.9,10.9 38.9,9.2 37.2,9.2 25.4,9.3 30.5,7.9 51.3,13.3 52,11.2 55.9,14.5 55.9,15.4 55.9,16.4 53.5,14.9 53.5,15.8 53.5,14 47.4,11.3 55.9,12.2 67.5,12.2 77.3,12.2 76.4,12.2 75.4,12.2 76.3,9.8 75.2,9.8 73,9.8 71.9,9.8 70.8,9.8 69.7,9.8 68.6,9.8 63.3,9.8 62.1,9.8 60.9,9.8 59.7,9.8 58.5,9.8 57.3,9.8 56.1,9.8 54.9,9.8 53.7,10 67.5,9.8 61.3,12.2 60.3,12.2 59.2,12.2 58.1,12.2 57,12.2 62.3,12.2 63.3,12.2 74.1,9.8 80.1,13.6 73.4,12.2 72.4,12.2 71.4,12.2 70.4,12.2 69.4,12.2 68.4,12.2 74.4,12.2 55.9,17.3 45.2,3.4 75.5,4.6 76.5,4.6 77.4,4.6 53.6,18.1 52.7,18.1 51.8,18.1 51.2,16.2 52.1,16.2 51.5,15.4 52.6,15.4 51.2,14.6 52.2,14.6 49.4,16.8 48.3,16.8 47.2,16.8 47.2,15.4 45.2,15.4 45.2,10.9 44.9,10 44.3,9.2 43.3,8.6 49.4,15 46.2,15.4 49.2,13 48.2,13 47.2,13 46.2,13 45.2,13 45.2,16.4 45.2,17.4 45,18.4 41.5,15.3 45.2,12 41.3,17.8 42.3,17.7 42.8,16.9 42.8,15.9 42.8,14.9 42.8,13.9 42.8,12.9 42.8,11.8 40.8,11.9 41.3,10.6 81.1,13.8 82.1,13.8 81.1,11.4 82.1,11.4 83.1,13.9 83.1,11.2 80.1,11.7 77.9,9.8 78.7,10.3 79.8,10.6 41.4,6.8 41.5,3.4 77.4,2.1 77.4,0.8 65.3,0.8 39.2,0.8 28.9,1 14.6,1 1,1 1,12.3 0.9,24.5 6.5,24.5 11.4,24.6 23.8,24.6 33.7,24.7 49,0.8 77.4,5.9 77.4,7.1 77.4,8.3 44.4,19.2 47.1,19.2 48.6,19.2 50,19.2 51.4,19.2 52.8,19.2 54.8,19.2 60.2,19.2 57.5,19.2 63,19.2 64.6,19.2 65.8,19.2 67,19.2 72.4,19.1 73.7,19.1 74.8,19.1 66.6,21.7 66.6,22.5 66.6,23.3 65.9,22.1 67.3,22.1 67.3,22.9 65.9,22.9 65.9,23.7 67.3,23.7 66.6,24.1 69.7,21.6 71,21.6 72.3,21.6 73.6,21.6 75,21.6 76.3,21.6 77.6,21.6 78.8,21.6 80.1,21.6 81.2,20.9 81.2,19.7 81.2,18.4 81.3,17.2 80.5,16.2 80.5,15.4 80.5,14.4 68.3,21.7 64.7,21.7 63.1,21.6 61.6,21.64 60.4,21.6 56.1,19.2 57.3,21.6 55.9,21.6 54.5,21.6 52.1,21.6 50.8,21.6 49.3,21.6 48.1,22.2 46.6,22.2 39.9,22.2 78.1,16.2 78.2,15.3 86.4,24.5 72.4,24.6 86.4,17.9 61.5,19.2 53.5,13.1 58.8,19.2 53.6,11.1 84.1,13.9 85.1,13.9 84.1,11.2 85.1,11.2 86.1,11.2 86.1,13.9 74,2.1 75.2,2.1 76.3,2.1 46,19.5 53.3,21.6 45.4,22.2 43.5,19.8 44.9,19.7 74.9,23.3 79.1,23.3 69.7,22.9 71,22.9 33.2,0.9 31.4,3.4 74.5,4.6
  pour Top (isolate 0.18, no thermals): -0.6,26.1 88.3,26.1 88.3,-0.5 -0.6,-0.5
  pour Bottom (isolate 0.18, no thermals): -1,26.9 89,26.9 89,-1.5 -1,-1.5
  pour Layer3 (no thermals): -0.1,25.6 87.8,25.6 87.8,-0.5 -0.1,-0.5
GNSS_RF
  Top 0.254: U$14.P$1 78.74,3.34 78.7,3.3
  Top 0.305: 77.38,3.3 76.92,3.3 C2.2
  Top 1.2: 78.7,3.3 77.38,3.3
GPS_IN  (via drill 0.25 pad 0.31)
  Top 0.152: U$11.6 R27.1 | 40.4,14 36.2,14 36,13.8 v35.4,13.8
  Top 0.154: U$1.9 30.68,14.78 31.4,15.5 32.1,14.8 32.1,14.5 v32.7,13.9 | 40.4,14 v42.1,12.3 | v42.1,8.3 45.8,4.6 47.38,4.6 R27.1
  Bottom 0.154: v32.7,13.9 33.9,13.9 34.1,13.7 35.1,13.7 v35.4,13.8 | v42.1,12.3 v42.1,8.3
LNA_IN
  Top 0.254: L15.2 79.08,10.98 79.35,11.25 U$6.P$11
LNA_OUT
  Top 0.254: U$5.2 41.55,9.55 41.6,9.6
  Top 0.305: U$2.2 41.15,19.45 41.7,18.9 | 41.6,9.6 41.8,9.5
  Top 0.406: 44.2,14.2 44,14.4
  Top 1.2: C21.1 44.2,14.2 | 41.7,18.9 42.3,18.9 arc-90 44,17.2 44,14.4 44,11.4 arc-90 41.8,9.5
LNAPWR  (via drill 0.25 pad 0.31)
  Top 0.152: R35.1 50.29,14.29 v50.1,14.5 | v49.8,18.2 50.42,18.2 C35.1 50.36,18.08 U$4.1
  Bottom 0.152: v50.1,14.5 50.1,17.9 v49.8,18.2
LNAPWR1
  Top 0.152: R35.2 50.45,12.33 U$19.3
MISO  (via drill 0.25 pad 0.31)
  Top 0.154: U$1.12 29.62,15.82 31.5,17.7 33.6,17.7 v33.6,17.8 v33.6,18.8 | U$2.13 35.89,19.9 33.8,19.9 v33.7,20 | U$5.13 34.85,10.05 34,10.9 34,14.9 34.3,15.2 v34.3,15.3
  Bottom 0.154: v33.6,18.8 33.6,19.8 v33.7,20 | v34.3,15.3 34.3,17.1 v33.6,17.8
MOSI  (via drill 0.25, 0.25 pad 0.31)
  Top 0.154: U$1.13 29.27,16.17 31.4,18.3 v31.6,18.3 | v32.7,19.4 34.9,19.4 | 34.9,19.4 35.89,19.4 U$2.14 | U$5.14 34.55,9.55 33.4,10.7 33.4,15.2 35.1,16.9 35.1,19.2 34.9,19.4
  Bottom 0.154: v31.6,18.3 v32.7,19.4
N$1
  Top 0.152: U$2.17 37.49,17.04 XTAL.1
N$2
  Top 0.254: C19.1 50.79,20.38 L7.2
  Top 0.305: L4.1 50.04,20.4 C19.1
N$3
  Top 0.254: L5.1 46.67,20.8 C18.1
  Top 0.305: L4.2 46.81,21.09 C18.1
N$4  (via drill 0.25 pad 0.31)
  Top 0.154: U$1.31 v26.55,11.32
  Bottom 0.154: v26.55,11.32 R1.2
N$5  (via drill 0.25 pad 0.31)
  Top 0.152: R19.1 33.51,23.61 34.4,24.4 60,24.4 61,23.5 62.1,23.5 v62.3,23.3 | v62.2,15.9 62.04,15.9 U$8.3 61.75,15.05 v63.9,12.9
  Top 0.406: v63.9,12.9 66.4,12.9 67.2,13.7 67.2,14.2 v67,14.4
  Bottom 0.152: v62.3,23.3 62.3,16 v62.2,15.9 | 65.4,11.3 65.4,10.22 U$3.P$3
  Bottom 0.254: 66.51,14.4 U$9.4
  Bottom 0.406: v63.9,12.9 63.9,12.8 65.4,11.3 | v67,14.4 66.51,14.4
N$6  (via drill 0.25 pad 0.31)
  Top 0.152: U$13.5 35.18,2.4 R21.2 36.18,1.4 v37.5,1.4 | U$15.P$11 53.85,7.45 v51.5,5.1
  Layer2 0.152: v51.5,5.1 51.5,1.7 51.2,1.4 40.3,1.4 40.1,1.6 37.7,1.6 v37.5,1.4
N$7
  Bottom 0.254: U$9.6 65.02,15.82 R11.2 64.98,16.8 R23.1
N$8
  Top 0.254: U$2.4 41.6,20.45 C11.1 41.43,21.12 L3.1
N$9
  Top 0.152: R22.1 32.07,1.78 U$13.3 U$13.2
N$10
  Top 0.152: 52.68,17.01 C20.1
  Top 0.406: U$4.6 52.68,17.01
N$11
  Top 0.406: U$4.3 48.55,15.71 C21.2
N$12
  Top 0.152: U$15.P$15 64.55,3.45 62.8,1.2 50.2,1.2 49.6,1.5 R25.2 47.42,2.68 U$11.5
N$13
  Top 0.152: U$2.16 36.99,15.74 XTAL.3
N$14
  Top 0.152: R26.1 44.22,2.7 U$11.2 U$11.3
N$15
  Top 0.254: L14.1 54.7,11.7 | 54.7,15.9 54.7,16.93 C20.2
  Top 1.2: 54.7,11.7 54.7,15.9
N$16
  cutout Layer3: 87.3,0 87.3,9 78,9 78,0
N$17  (via drill 2.8)
  other vias: 4.2,19.6
N$18
  Bottom 0.152: R23.2 66.75,16.91 67,16.5 67,15.2 66.42,15.2 U$9.5
N$19
  Top 0.406: U$12.4 U$12.5 20.12,24.06 C53.1 16.89,24.06 L17.2
N$20
  Top 0.305: L6.1 44.17,21.16 C49.1 45.38,21.13 L5.2
N$21  (via drill 2.8)
  other vias: 4.1,5.4
N$22
  Top 0.152: R34.1 52.16,10.02 U$19.6 U$19.5
N$23
  Top 0.254: L1.2 68.24,20.26 U$7.3 69.42,20.44 C39.1 70.97,20.17 C37.1 71.96,20.19 L9.1
N$25
  Top 0.254: L8.2 65.02,20.4 U$7.1
N$26
  Top 0.152: R6.1 59.18,21.15 L2.2
  Top 0.254: L2.2 59.48,20.4 C34.1 60.49,20.42 | C32.1 62.14,20.44 L8.1
  Top 0.305: 60.49,20.42 61.48,20.42 C32.1
N$27
  Top 0.254: C29.2 55.84,20.41 C31.1 56.79,20.35 C30.1 57.39,20.36 L2.1
N$28
  Top 0.254: L9.2 74.83,20.36 C36.1 75.96,20.2 L10.1
N$29
  Top 0.254: L10.2 78.89,20.36 C42.1 79.09,19.21 79.1,19.2 | 79.1,19.2 78.53,19.2 C38.1 | L13.1 79.11,19.19 79.1,19.2
N$30
  Top 0.152: R8.2 64.11,5.49 64.5,5.5 68.23,5.5 U$15.P$13
N$31
  Bottom 0.254: 70.89,15 R18.2 70.94,14.83
  Bottom 0.406: IC2.3 72.35,15.35 72,15 70.89,15 | R17.1 70.94,14.83
N$32
  Bottom 0.254: R13.1 77.76,18.5 IC2.2
N$33
  Top 0.254: C2.1 74.02,3.29 U$15.P$1
N$34
  Top 0.152: C26.1 59.78,10.93 L16.2 61.23,10.83 C25.2 62.35,10.87 C27.2
N$35
  Top 0.152: C27.1 64.69,10.93 L15.1
N$36
  Top 0.254: L14.2 57.34,10.97 C26.2
N$37
  Bottom 0.254: 68.91,14.52 R18.1
  Bottom 0.406: U$9.3 68.91,14.52
N$38
  Top 0.152: U$5.17 37.54,7.13 XTAL1.1
N$39
  Top 0.152: U$5.16 37.04,6.25 XTAL1.3
N$40
  Top 0.152: U$8.5 U$8.6 59.99,17.21 R3.2
N$41
  Top 0.152: U$8.4 63.06,17.21 R12.2
N$42
  Top 0.152: U$10.3 R19.2 31.25,22.65 R20.1
N$43
  Top 0.254: C38.2 79.3,17.42 | 79.3,17.42 79.93,17.42 L13.2 | C44.1 79.31,17.41 79.3,17.42
N$45
  Top 0.152: J$1.SIG 84.85,12.6 85.29,12.6
  Top 0.254: U$6.P$2 80.88,12.62 80.9,12.6
  Top 0.813: 80.9,12.6 81.1,12.6
  Top 1.2: 85.29,12.6 81.1,12.6
N$46
  Top 0.406: D1.C 12.87,23.39 C50.1 14.24,23.44 L17.1
N$47
  Bottom 0.254: IC2.1 78.86,19.92 R13.2 80.09,19.94 R14.1
N$48  (via drill 0.25 pad 0.31)
  Top 0.254: R3.1 59.5,15.52 59.5,14.5 59.9,14.1 D3.C v60.4,14.1 | v63.3,14.6 63.3,15.69 R12.1
  Bottom 0.254: 64.8,14.6 R11.1
  Bottom 0.305: 64.98,14.22 R11.1
  Bottom 0.406: 64.98,14.22 65.8,13.4 69.03,13.4 R17.2 | v60.4,14.1 62.8,14.1 v63.3,14.6 64.8,14.6
N$50
  Top 0.254: C11.2 42.69,20.79 L6.2
N$51
  Top 0.254: L3.2 41.33,23.47 R5.2 41.23,23.58 C40.1
N$56
  Top 0.152: U$12.1 18.32,18.28 C58.2
N$58
  Top 0.152: L18.1 16.58,20.07 C58.1 18.48,20.58 U$12.6 18.72,20.58 17.9,21.4 17.9,22.32 D2.C
N$61
  Top 0.152: U$12.3 22.33,18.28 R24.1 22.5,18.45 22.5,17.1 20.72,15.32 R4.1
N$89
  Top 0.152: R10.2 54.62,23.58 R9.2 55.86,23.68 C7.1 58.31,23.72 R6.2
NRST  (via drill 0.25 pad 0.31)
  Top 0.152: U$1.4 29.6,12.2 v29.6,10.9 | C8.2 25.22,6.12 v25.5,6.4
  Top 0.254: NRST.2 v25.5,6.4
  Layer2 0.152: v29.6,10.9 29.6,6.4 v25.5,6.4
  Bottom 0.152: v25.5,6.4 18.94,6.4 RST.1
P1_1
  Top 0.154: U$1.15 28.56,16.86 33.7,22 U$2.10
P1_2  (via drill 0.25 pad 0.31)
  Top 0.154: U$1.27 25.63,13.23 24.5,12.1 24.5,9.1 26.5,7.1 v34.2,7.1 | v35.2,11.9 36.94,11.9 U$5.10
  Layer2 0.154: v34.2,7.1 34.2,11 v35.2,11.9
P2_1  (via drill 0.25 pad 0.31)
  Top 0.152: v38.5,17.1 U$2.19
  Top 0.154: U$1.7 30.33,13.57 31.6,12.3 32.6,12.3 v32.8,12.5 | U$2.19
  Layer2 0.152: 40.3,12.5 40.3,16.5 39.9,16.9 38.6,16.9 v38.5,17.1
  Layer2 0.154: v32.8,12.5 40.3,12.5
P3_2  (via drill 0.25 pad 0.31)
  Top 0.154: U$1.26 25.29,13.59 23.8,12.1 v23.8,10.8 | v40,2.4 40,6.4 39.1,7.3 39.1,7.94 U$5.20
  Bottom 0.154: v23.8,10.8 23.8,8.9 26.2,6.5 34.6,6.5 34.6,4.6 37,2.2 39.8,2.2 v40,2.4
PA_IN
  Top 0.254: L7.1 52.8,20.4 C29.1
PA_OUT
  Top 0.254: C44.2 79.31,13.56 U$6.P$5
PA_PWR  (via drill 0.25, 0.25 pad 0.31)
  Top 0.406: L1.1 70.64,17.44 v70.7,17.5 v70.71,17.49 | v69.8,17.9 v69.8,17
  Top 0.813: C13.1 v70.71,17.49
  Bottom 0.406: v70.7,17.5 71.46,17.5 IC2.4 70.04,17.66 v69.8,17.9
PPS  (via drill 0.25 pad 0.31)
  Top 0.152: v33.3,5.8 33.52,5.58 R28.1 33.7,4.32 U$13.6 | v31.8,13.1 31.52,13.1 U$1.8
  Layer2 0.152: v33.3,5.8 33.3,10.4 31.7,12 31.7,13 v31.8,13.1
RFSW_CTL  (via drill 0.25, 0.25 pad 0.31)
  Top 0.152: R33.2 v52.99,12.31 52.7,12.6 51.6,12.6 51.4,12.4 51.4,11.85 U$19.2 51.3,11.75 51.3,11.2 51.25,11.15 R2.2 49.47,11.1 v48.3,11.1 | v72.7,16.2 76.14,16.2 R15.2 | v55.9,13.2 60.9,13.2 | 60.9,13.2 v62.2,13.2 | U$8.2 61.1,13.5 60.9,13.2 | v34.9,7.6 33.3,9.2 29.5,9.2 29,9.7 29,11.4 28.58,11.82 U$1.2
  Layer2 0.152: v72.7,16.2 72.7,13.6 62.4,13.6 v62.2,13.2 | v34.9,7.6 v43.8,7.6
  Bottom 0.152: v52.99,12.31 54.81,12.31 v55.9,13.2 | v43.8,7.6 44.8,7.6 v48.3,11.1
RFSWCTL
  Top 0.152: R15.1 R16.2 76.25,14 76.9,14 77.78,13.12 U$6.P$7
RX
  Top 0.152: U$1.20 25.2,17.3 24.3,17.3 22.8,15.8 22.8,15.1 20.7,13 16.3,13 14.8,11.5 12.47,11.5 X1.3
SCLK  (via drill 0.25 pad 0.31)
  Top 0.152: 35.89,20.4 34.7,20.4 v34.5,20.6
  Top 0.154: U$1.11 29.98,15.48 31.7,17.2 33,17.2 | 33,17.2 33.9,17.2 34.5,17.8 v34.5,18.8 | 35.89,20.4 U$2.12 | U$5.12 35.15,10.55 34.6,11.1 v34.6,14.4 | v32.8,14.8 32.8,17 33,17.2
  Bottom 0.154: v34.5,18.8 v34.5,20.6 | v34.6,14.4 33.2,14.4 v32.8,14.8
SDN1  (via drill 0.25 pad 0.31)
  Top 0.154: U$1.14 28.99,16.49 31.5,19 32.1,19 v32.8,18.3 | v40.5,18.4 40.5,18.9 40.09,18.9 U$2.1
  Layer2 0.154: v32.8,18.3 40.4,18.3 v40.5,18.4
SDN2  (via drill 0.25 pad 0.31)
  Top 0.154: U$1.25 24.34,13.34 v24,13.4 | v40.1,8.2 U$5.1
  Bottom 0.154: v24,13.4 24,12.3 26.6,9.7 33.6,9.7 35.3,8 39.9,8 v40.1,8.2
SWC
  Top 0.152: U$1.24 24.96,14.74 24.5,15.2 24.3,15.2 20.6,11.5 20.6,9.2 20.3,8.9 18.85,8.9 SWC.1
SWD
  Top 0.152: U$1.23 25.31,15.09 24.2,16.2 23.9,16.2 23.4,15.7 23.4,15 19.8,11.4 SWD.1
TX
  Top 0.152: U$1.19 25.4,17.8 24.2,17.8 22.3,15.9 22.3,15.2 20.5,13.4 15.6,13.4 14.9,14.1 12.51,14.1 X1.2
TXCTL  (via drill 0.25, 0.25 pad 0.31)
  Top 0.152: U$1.29 26.37,12.47 25.4,11.5 25.4,10.4 26,9.8 27.14,9.8 27.34,10.04 v27.4,10.3 | v51.6,23.6 52.31,23.6 R10.1
  Bottom 0.152: U$9.2 67.96,15.2 67.5,15.2 67.4,15.3 67.4,17.62 R7.2 64.5,18.1 63.9,18.7 63.9,23 62.7,24.2 61.4,24.2 60,22.8 51.9,22.8 51.6,23.1 v51.6,23.6 41.4,23.6 41.1,23.3 34.1,23.3 30.8,20 v30.8,11.1 30,10.3 v27.4,10.3
V18  (via drill 0.33 pad 0.74)
  Top 0.152: U1.5 59.66,4.05 C3.2 60.9,4 C4.2 60.96,4.05 R8.1 63.75,4.05 v63.8,4 | U$15.P$19 72.1,2.47 v72.1,4.9 72.1,4.8 73,5.9 | 73,5.9 73.45,5.45 U$15.P$3 | 73,5.9 73,8.43 U$15.P$6
  Layer2 0.152: v63.8,4 65,4.9 v72.1,4.9
VDD  (via drill 0.25 pad 0.31)
  Top 0.305: D3.A v58,14.1
  Top 0.406: X1.1 10.14,18.91 D1.A 10.14,21.24 10.2,21.3 10.9,21.3 v11.3,21.7
  Layer2 0.254: 58.1,14.2 v58,14.1
  Layer2 0.406: 58.1,14.2 58.1,22.9 56.5,24.4 56.4,24.5 51,24.5 50.4,23.9 15.4,23.9 13.2,21.7 v11.3,21.7
(copper drawn outside any net)
  shapes: Top area x62

### Text on the board
tNames: 12V | TX | RX | GND | AIS Transponder / Rev 4.2 / (c)2017 / Peter Antypas